# Altium project ToF_Sensor_Breakout_v1.PrjPcb
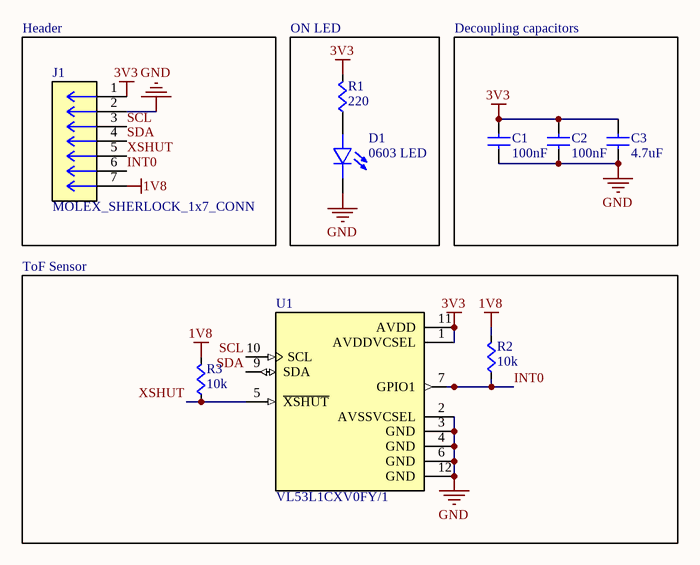
[diagram p0: main.SchDoc]
1 sheet, 9 parts. Net scope: global (net labels, ports and power ports of the same name join across sheets).
Board file: main.PcbDoc

## Sheet main.SchDoc
size A; Author: Aiden Shepler; Revision: 0; SheetNumber: 1; SheetTotal: 1; Author1: Aiden Shepler; Project: ToF Breakout Board; VersionControl_Repository: TerraGator/ToF-breakout-board

### Parts
C1  value 100nF  [CAPC0603]  (hidden comment: Cap)
C2  value 100nF  [CAPC0603]  (hidden comment: Cap)
C3  value 4.7uF  [CAPC0603]  (hidden comment: Cap)
D1  0603 LED  [0603 (LED)]
J1  MOLEX_SHERLOCK_1x7_CONN  [CON_353620750]
R1  value 220  [RES0603]  (hidden comment: Res)
R2  value 10k  [RES0603]  (hidden comment: Res)
R3  value 10k  [RES0603]  (hidden comment: Res)
U1  VL53L1CXV0FY/1  [LGA-12 (VL53L1CXV0FY/1)]

### Blocks framed on the sheet
Header: J1
ON LED: D1 R1
Decoupling capacitors: C1-C3
ToF Sensor: R2 R3 U1

### Nets
1V8: J1.7 R2.1(A) R3.1(A)
3V3: C1.1(A) C2.1(A) C3.1(A) J1.1 R1.1(A) U1.1(AVDDVCSEL) U1.11(AVDD)
GND: C1.2(B) C2.2(B) C3.2(B) D1.C J1.2 U1.2(AVSSVCSEL) U1.3(GND) U1.4(GND) U1.6(GND) U1.12(GND)
INT0: J1.6 R2.2(B) U1.7(GPIO1)
SCL: J1.3 U1.10(SCL)
SDA: J1.4 U1.9(SDA)
XSHUT: J1.5 R3.2(B) U1.5(~{XSHUT})
NetD1_A: D1.A R1.2(B)

### Notes on the sheet
- Project/Vehicle:
- Author(s):
- -
- Revisor(s):
- Git Repo:
- Git Hash:
- Date:
- Revision:
- Size:
- A
- File:
- Sheet
- of

### Library data of the parts
D1 = 0603 LED: 150060SS75000 | LED Indication - Discrete 1.9V 0603 (1608 Metric)
J1 = MOLEX_SHERLOCK_1x7_CONN: 1x7 2mm pitch sherlock connector; MP: 353620750; Package: None; Price: None; Value: *; Availability: Unavailable
R1-R3 = Res: SMD, RES0603; Supplier 1: Digi-Key; Supplier Part Number 1: RMCF0603JT10K0CT-ND
U1 = VL53L1CXV0FY/1: ToF Optical Sensor 157.480 (4m) I²C Output from STMelectronics; MF: STMicroelectronics; SnapEDA_Link: https://www.snapeda.com/parts/VL53L1CXV0FY/1/STMicroelectronics/view-part/?ref=snap; Package: LGA-12 STMicroelectronics; MP: VL53L1CXV0FY/1; Check_prices: https://www.snapeda.com/parts/VL53L1CXV0FY/1/STMicroelectronics/view-part/?ref=eda; Purchase-URL: https://pricing.snapeda.com/search/part/VL53L1CXV0FY/1/?ref=eda; Price: None; Value: *; Availability: In Stock
C1-C3 = Cap: Supplier 1: Digi-Key; Supplier Part Number 1: 1276-1000-1-ND